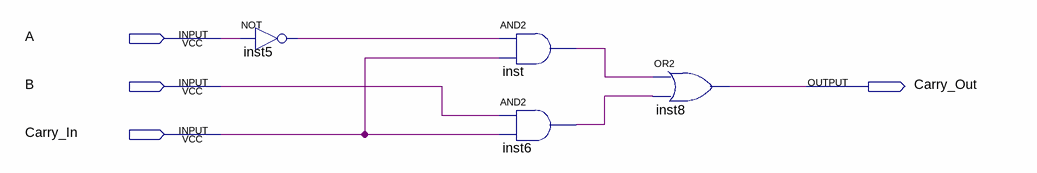
[diagram p0: schematic sheet]
// Quartus schematic MenorQ1Bit.bdf as structural Verilog: 4 symbols, 4 pins
module MenorQ1Bit (
  input  A,
  input  B,
  input  Carry_In,
  output Carry_Out
);

  wire inst5_out, inst6_out, inst_out;

  not inst5 (inst5_out, A);
  and inst (inst_out, inst5_out, Carry_In);
  and inst6 (inst6_out, B, Carry_In);
  or inst8 (Carry_Out, inst_out, inst6_out);
endmodule
